# EAGLE schematic new_schematic (EAGLE 7.5.0)
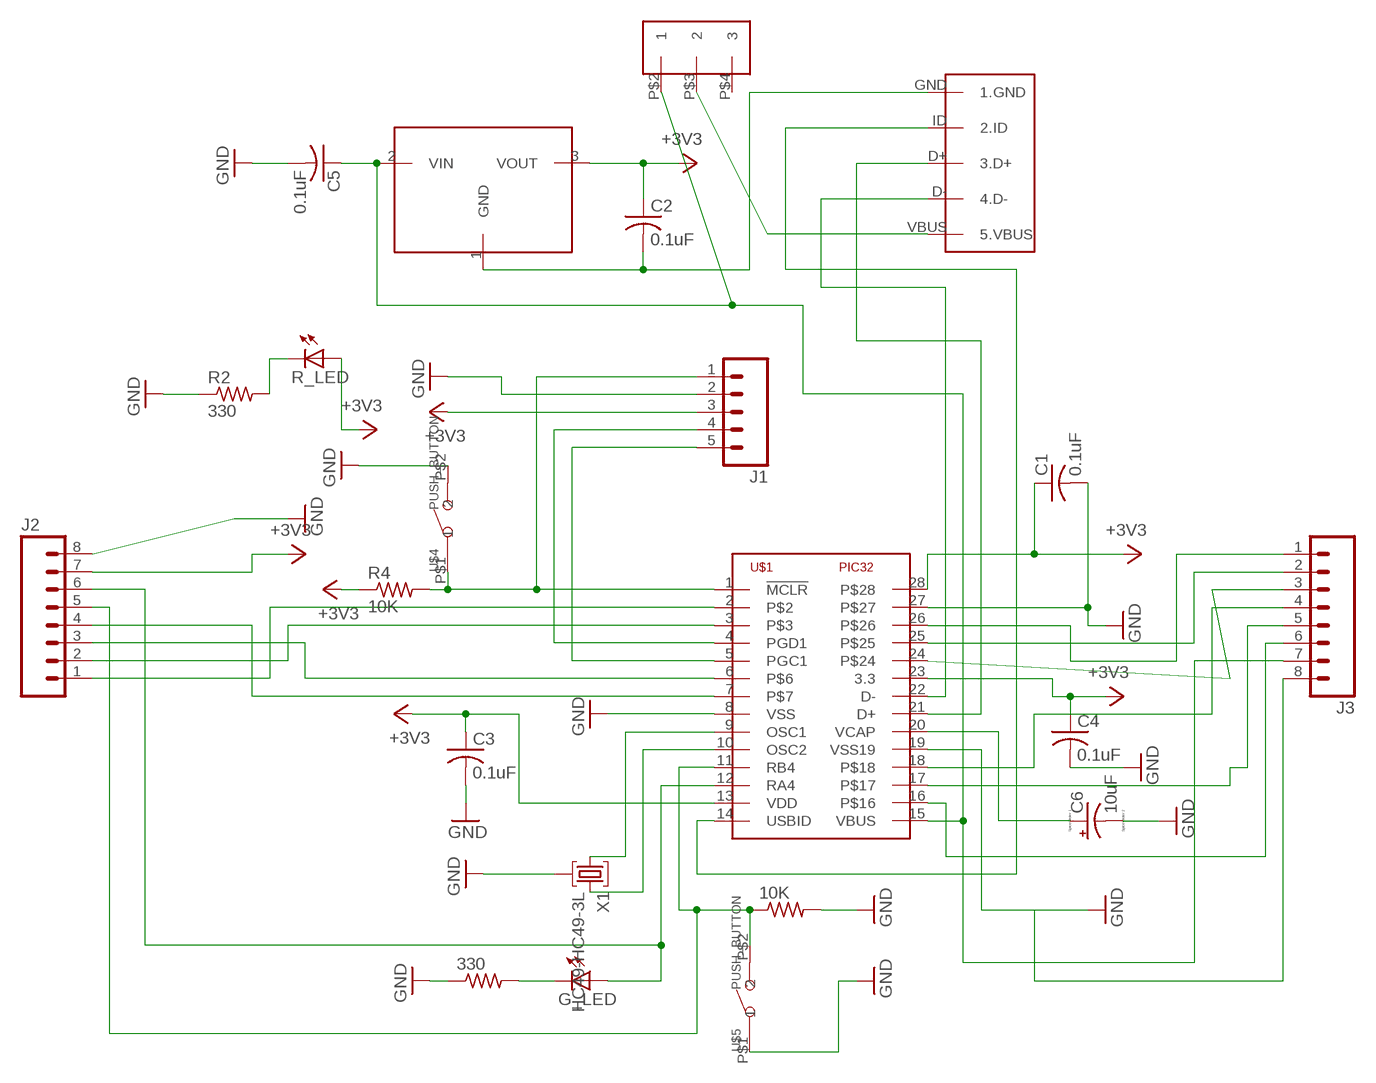
[diagram p0: schematic, sheet 1]

## Parts
10K  R-US_0207/10  [0207/10]
330  R-US_0207/10  [0207/10]
C1  0.1uF  C-US025-025X050  [C025-025X050]
C2  0.1uF  C-US025-025X050  [C025-025X050]
C3  0.1uF  C-US025-025X050  [C025-025X050]
C4  0.1uF  C-US025-025X050  [C025-025X050]
C5  0.1uF  C-US025-025X050  [C025-025X050]
C6  10uF  CPOL-US150CLZ-0810  [150CLZ-0810]
G_LED  LED3MM  [LED3MM]
J1  M05NO_SILK  [1X05_NO_SILK]
J2  M08  [1X08_ROUND]
J3  M08  [1X08_ROUND]
R2  330  R-US_0207/10  [0207/10]
R4  10K  R-US_0207/10  [0207/10]
R_LED  LED3MM  [LED3MM]
U$1  PIC32  [DIL28-3]
U$2  MINI_USB  [USB-MB-H]
U$3  SLIDE_SWITCH  [SLIDE_SWITCH]
U$4  PUSH_BUTTON  [PUSH_BUTTON]
U$5  PUSH_BUTTON  [PUSH_BUTTON]
U$9  MCP1702  [TO92]
X1  HC49-HC49-3L  [HC49-3L]

## Nets
+3V3: C1.1 C2.1 C3.1 C4.1 J1.3 J2.7 R4.1 R_LED.A U$1.13(VDD) U$1.23(3.3) U$1.28 U$9.3(VOUT)
GND: 10K.2 330.1 C1.2 C3.2 C4.2 C5.2 C6.- J1.2 J2.8 J3.8 R2.1 U$1.8(VSS) U$1.19(VSS19) U$1.27 U$4.P$2 U$5.P$1 X1.2
N$1: U$1.14(USBID) U$2.ID(2.ID)
N$2: J1.4 U$1.4(PGD1)
N$3: J1.5 U$1.5(PGC1)
N$4: U$1.9(OSC1) X1.1
N$5: U$1.10(OSC2) X1.3
N$6: 10K.1 J2.5 U$1.11(RB4) U$5.P$2
N$7: C2.2 U$2.GND(1.GND) U$9.1(GND)
N$8: R2.2 R_LED.K(C)
N$9: J1.1 R4.2 U$1.1(!MCLR) U$4.P$1
N$10: C6.+ U$1.20(VCAP)
N$11: 330.2 G_LED.K(C)
N$12: G_LED.A J2.6 U$1.12(RA4)
N$13: U$2.VBUS(5.VBUS) U$3.P$3
N$14: C5.1 J3.7 U$1.15(VBUS) U$3.P$2 U$9.2(VIN)
N$15: U$1.22(D-) U$2.D-(4.D-)
N$16: U$1.21(D+) U$2.D+(3.D+)
N$19: J2.1 U$1.2
N$20: J2.2 U$1.3
N$21: J2.3 U$1.6
N$22: J2.4 U$1.7
N$23: J3.1 U$1.26
N$24: J3.2 U$1.25
N$25: J3.3 U$1.24
N$26: J3.4 U$1.18
N$27: J3.5 U$1.17
N$28: J3.6 U$1.16
Unconnected: U$3.P$4

## Library data of the parts
10K 330 R2 R4 = new_library:R-US_: RESISTOR, American symbol
C1-C5 = new_library:C-US: CAPACITOR, American symbol
C6 = new_library:CPOL-US: POLARIZED CAPACITOR, American symbol
G_LED R_LED = new_library:LED: LED OSRAM: - CHIPLED LG R971, LG N971, LY N971, LG Q971, LY Q971, LO R971, LY R971 LH N974, LH R974 LS Q976, LO Q976, LY Q976 LO Q996 - Hyper CHIPLED LW Q18S LB Q993, LB Q99A, LB R99A - SideLED LS A670, LO A670, LY A670, LG A670, LP A670 LB A673, LV A673, LT A673, LW A673 LH A674 LY A675 LS A676, LA A676, LO A676, LY A676, LW A676 LS A679, LY A679, LG A679 - Hyper Micro SIDELED® LS Y876, LA Y876, LO Y876, LY Y876 LT Y87S - SmartLED LW L88C, LW L88S LB L89C, LB L89S, LG L890 LS L89K, LO L89K, LY L89K LS L896, LA L896, LO L896, LY L896 - TOPLED LS T670, LO T670, LY T670, LG T670, LP T670 LSG T670, LSP T670, LSY T670, LOP T670, LYG T670 LG T671, LOG T671, LSG T671 LB T673, LV T673, LT T673, LW T673 LH T674 LS T676, LA T676, LO T676, LY T676, LB T676, LH T676, LSB T676, LW T676 LB T67C, LV T67C, LT T67C, LS T67K, LO T67K, LY T67K, LW E67C LS E67B, LA E67B, LO E67B, LY E67B, LB E67C, LV E67C, LT E67C LW T67C LS T679, LY T679, LG T679 LS T770, LO T770, LY T770, LG T770, LP T770 LB T773, LV T773, LT T773, LW T773 LH T774 LS E675, LA E675, LY E675, LS T675 LS T776, LA T776, LO T776, LY T776, LB T776 LHGB T686 LT T68C, LB T68C - Hyper Mini TOPLED® LB M676 - Mini TOPLED Santana® LG M470 LS M47K, LO M47K, LY M47K Source: http://www.osram.convergy.de LUXEON: - LUMILED® LXK2-PW12-R00, LXK2-PW12-S00, LXK2-PW14-U00, LXK2-PW14-V00 LXK2-PM12-R00, LXK2-PM12-S00, LXK2-PM14-U00 LXK2-PE12-Q00, LXK2-PE12-R00, LXK2-PE12-S00, LXK2-PE14-T00, LXK2-PE14-U00 LXK2-PB12-K00, LXK2-PB12-L00, LXK2-PB12-M00, LXK2-PB14-N00, LXK2-PB14-P00, LXK2-PB14-Q00 LXK2-PR12-L00, LXK2-PR12-M00, LXK2-PR14-Q00, LXK2-PR14-R00 LXK2-PD12-Q00, LXK2-PD12-R00, LXK2-PD12-S00 LXK2-PH12-R00, LXK2-PH12-S00 LXK2-PL12-P00, LXK2-PL12-Q00, LXK2-PL12-R00 Source: www.luxeon.com KINGBRIGHT: KA-3528ASYC Source: www.kingbright.com
J1 = new_library:M05: Header 5 Standard 5-pin 0.1" header. Use with straight break away headers (SKU : PRT-00116), right angle break away headers (PRT-00553), swiss pins (PRT-00743), machine pins (PRT-00117), and female headers (PRT-00115). Molex polarized connector foot print use with SKU : PRT-08230 with associated crimp pins and housings.
J2 J3 = new_library:M08: Header 8 Standard 8-pin 0.1" header. Use with straight break away headers (SKU : PRT-00116), right angle break away headers (PRT-00553), swiss pins (PRT-00743), machine pins (PRT-00117), and female headers (PRT-00115).; PROD_ID: CONN-08437
U$1 = new_library:PIC32
U$2 = new_library:MINI_USB
U$3 = new_library:SLIDE_SWITCH
U$4 U$5 = new_library:PUSH_BUTTON
U$9 = new_library:MCP1702
X1 = new_library:HC49: Crystals; MFD: IQD Frequency Products